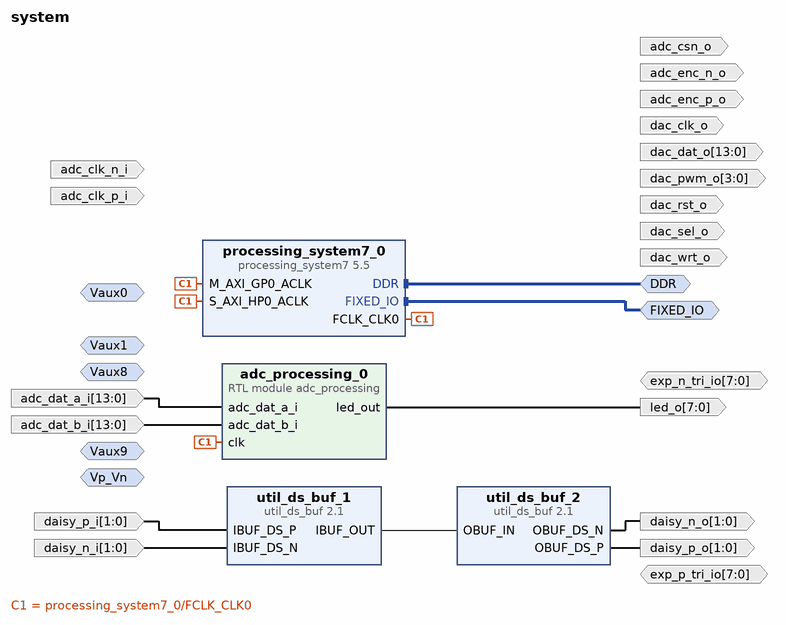
[diagram p0: block diagram of the top level]
# Vivado block design system, xc7z010clg400-1, Vivado 2017.1
create_bd_design system

create_bd_intf_port -mode Master -vlnv xilinx.com:interface:ddrx_rtl:1.0 DDR
create_bd_intf_port -mode Master -vlnv xilinx.com:display_processing_system7:fixedio_rtl:1.0 FIXED_IO
create_bd_intf_port -mode Slave -vlnv xilinx.com:interface:diff_analog_io_rtl:1.0 Vp_Vn
create_bd_intf_port -mode Slave -vlnv xilinx.com:interface:diff_analog_io_rtl:1.0 Vaux0
create_bd_intf_port -mode Slave -vlnv xilinx.com:interface:diff_analog_io_rtl:1.0 Vaux1
create_bd_intf_port -mode Slave -vlnv xilinx.com:interface:diff_analog_io_rtl:1.0 Vaux9
create_bd_intf_port -mode Slave -vlnv xilinx.com:interface:diff_analog_io_rtl:1.0 Vaux8
create_bd_port -dir O adc_enc_p_o
create_bd_port -dir O adc_enc_n_o
create_bd_port -dir O adc_csn_o
create_bd_port -dir O -from 13 -to 0 dac_dat_o
create_bd_port -dir O dac_clk_o
create_bd_port -dir O dac_rst_o
create_bd_port -dir O dac_sel_o
create_bd_port -dir O dac_wrt_o
create_bd_port -dir O -from 3 -to 0 dac_pwm_o
create_bd_port -dir IO -from 7 -to 0 exp_p_tri_io
create_bd_port -dir IO -from 7 -to 0 exp_n_tri_io
create_bd_port -dir I adc_clk_p_i
create_bd_port -dir I adc_clk_n_i
create_bd_port -dir I -from 1 -to 0 daisy_p_i
create_bd_port -dir I -from 1 -to 0 daisy_n_i
create_bd_port -dir O -from 1 -to 0 daisy_p_o
create_bd_port -dir O -from 1 -to 0 daisy_n_o
create_bd_port -dir O -from 7 -to 0 led_o
create_bd_port -dir I -from 13 -to 0 adc_dat_a_i
create_bd_port -dir I -from 13 -to 0 adc_dat_b_i

create_bd_cell -type ip -vlnv xilinx.com:ip:processing_system7:5.5 processing_system7_0
set_property -dict [list \
  CONFIG.PCW_USE_S_AXI_HP0 1 \
  CONFIG.PCW_IMPORT_BOARD_PRESET cfg/red_pitaya.xml \
] [get_bd_cells processing_system7_0]
create_bd_cell -type ip -vlnv xilinx.com:ip:util_ds_buf:2.1 util_ds_buf_1
set_property -dict {CONFIG.C_SIZE 2} [get_bd_cells util_ds_buf_1]
create_bd_cell -type ip -vlnv xilinx.com:ip:util_ds_buf:2.1 util_ds_buf_2
set_property -dict {CONFIG.C_SIZE 2 CONFIG.C_BUF_TYPE OBUFDS} [get_bd_cells util_ds_buf_2]
create_bd_cell -type module -reference adc_processing adc_processing_0

# ---- connections ----

connect_bd_intf_net [get_bd_intf_ports DDR] [get_bd_intf_pins processing_system7_0/DDR]
connect_bd_intf_net [get_bd_intf_ports FIXED_IO] [get_bd_intf_pins processing_system7_0/FIXED_IO]
connect_bd_net [get_bd_ports daisy_p_i] [get_bd_pins util_ds_buf_1/IBUF_DS_P]
connect_bd_net [get_bd_ports daisy_n_i] [get_bd_pins util_ds_buf_1/IBUF_DS_N]
connect_bd_net [get_bd_pins util_ds_buf_2/OBUF_DS_P] [get_bd_ports daisy_p_o]
connect_bd_net [get_bd_pins util_ds_buf_2/OBUF_DS_N] [get_bd_ports daisy_n_o]
connect_bd_net [get_bd_pins util_ds_buf_1/IBUF_OUT] [get_bd_pins util_ds_buf_2/OBUF_IN]
connect_bd_net [get_bd_pins processing_system7_0/FCLK_CLK0] \
  [get_bd_pins processing_system7_0/M_AXI_GP0_ACLK] [get_bd_pins processing_system7_0/S_AXI_HP0_ACLK] \
  [get_bd_pins adc_processing_0/clk]
connect_bd_net [get_bd_pins adc_processing_0/led_out] [get_bd_ports led_o]
connect_bd_net [get_bd_ports adc_dat_a_i] [get_bd_pins adc_processing_0/adc_dat_a_i]
connect_bd_net [get_bd_ports adc_dat_b_i] [get_bd_pins adc_processing_0/adc_dat_b_i]

validate_bd_design
save_bd_design
